# Altium schematic sheet Buck_Sense.SchDoc
size A4
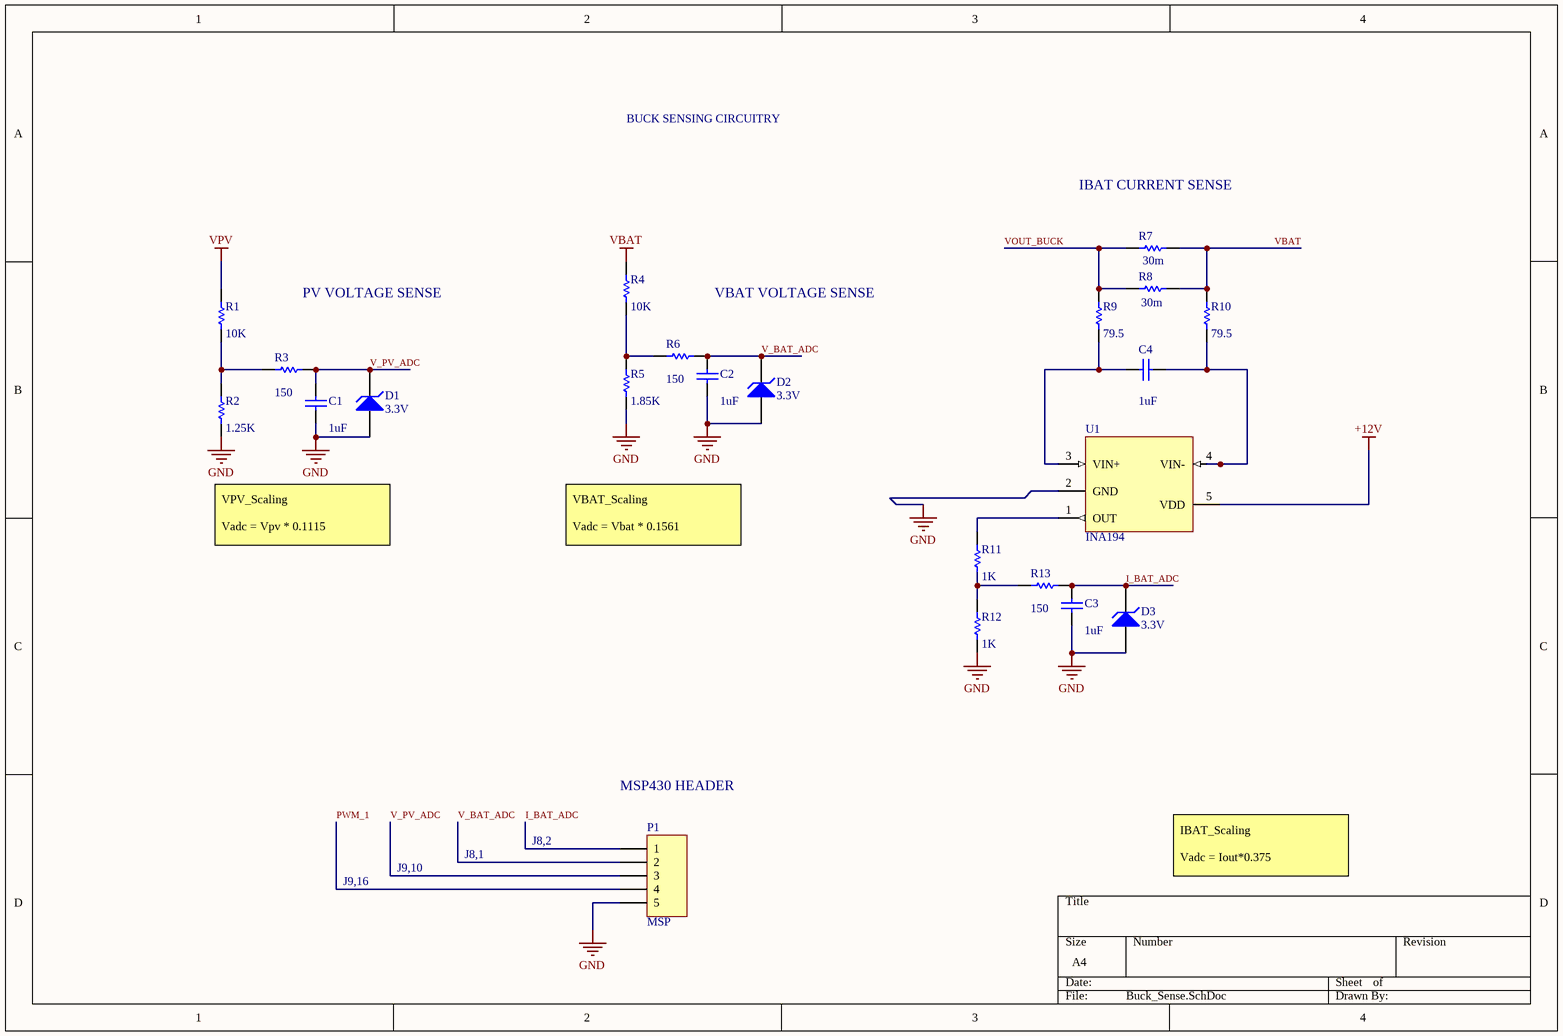
[diagram p0: Buck_Sense.SchDoc]

## Parts
C1  value 1uF  [RAD-0.3]
C2  value 1uF  [RAD-0.3]
C3  value 1uF  [RAD-0.3]
C4  value 1uF  [RAD-0.3]
D1  3.3V  [DIODE-0.7]
D2  3.3V  [DIODE-0.7]
D3  3.3V  [DIODE-0.7]
P1  MSP  [HDR1X5]
R1  value 10K  [AXIAL-0.3]
R2  value 1.25K  [AXIAL-0.3]
R3  value 150  [AXIAL-0.3]
R4  value 10K  [AXIAL-0.3]
R5  value 1.85K  [AXIAL-0.3]
R6  value 150  [AXIAL-0.3]
R7  value 30m  [AXIAL-0.3]
R8  value 30m  [AXIAL-0.3]
R9  value 79.5  [AXIAL-0.3]
R10  value 79.5  [AXIAL-0.3]
R11  value 1K  [AXIAL-0.3]
R12  value 1K  [AXIAL-0.3]
R13  value 150  [AXIAL-0.3]
U1  INA194

## Nets
+12V: U1.5(VDD)
GND: C1.1 C2.1 C3.1 D1.1(A) D2.1(A) D3.1(A) P1.5 R2.1 R5.1 R12.2 U1.2(GND)
VBAT: R4.2 R7.1 R8.1 R10.1
VPV: R1.2
I_BAT_ADC: C3.2 D3.2(K) P1.1 R13.2
PWM_1: P1.4
V_BAT_ADC: C2.2 D2.2(K) P1.2 R6.1
V_PV_ADC: C1.2 D1.2(K) P1.3 R3.2
VOUT_BUCK: R7.2 R8.2 R9.1
NetC4_1: C4.1 R10.2 U1.4(VIN-)
NetC4_2: C4.2 R9.2 U1.3(VIN+)
NetR1_1: R1.1 R2.2 R3.1
NetR4_1: R4.1 R5.2 R6.2
NetR11_1: R11.1 U1.1(OUT)
NetR11_2: R11.2 R12.1 R13.1

## Notes on the sheet
- BUCK SENSING CIRCUITRY
- IBAT CURRENT SENSE
- PV VOLTAGE SENSE
- VBAT VOLTAGE SENSE
- VPV_Scaling
  Vadc = Vpv * 0.1115
- VBAT_Scaling
  Vadc = Vbat * 0.1561
- MSP430 HEADER
- J8,2
- J9,16
- J9,10
- J8,1
- IBAT_Scaling
  Vadc = Iout*0.375

## Library data of the parts
C1-C4 = Cap: Capacitor; Published: 8-Jun-2000; LatestRevisionDate: 17-Jul-2002; LatestRevisionNote: Re-released for DXP Platform.; PackageReference: RAD-0.3; Publisher: Altium Limited; PackageDescription: Radial Cap, Thru-Hole; 2 Leads; 0.3 in Pin Spacing
D1-D3 = D Zener: Zener Diode; Published: 8-Jun-2000; LatestRevisionDate: 17-Jul-2002; LatestRevisionNote: Re-released for DXP Platform.; PackageReference: DIODE-0.7; Publisher: Altium Limited; PackageDescription: Diode, Thru-Hole; 2 Leads; 0.7 in Pin Spacing
P1 = Header 5: Header, 5-Pin; LatestRevisionDate: 17-Jul-2002; LatestRevisionNote: Re-released for DXP Platform.; Publisher: Altium Limited
R1-R13 = Res1: Resistor; Published: 8-Jun-2000; LatestRevisionDate: 17-Jul-2002; LatestRevisionNote: Re-released for DXP Platform.; PackageReference: AXIAL-0.3; Publisher: Altium Limited; PackageDescription: Axial Device, Thru-Hole; 2 Leads; 0.3 in Pin Spacing
U1 = INA194: CURRENT SHUNT MONITOR